# EAGLE design firefly-light (EAGLE 9.5.2)
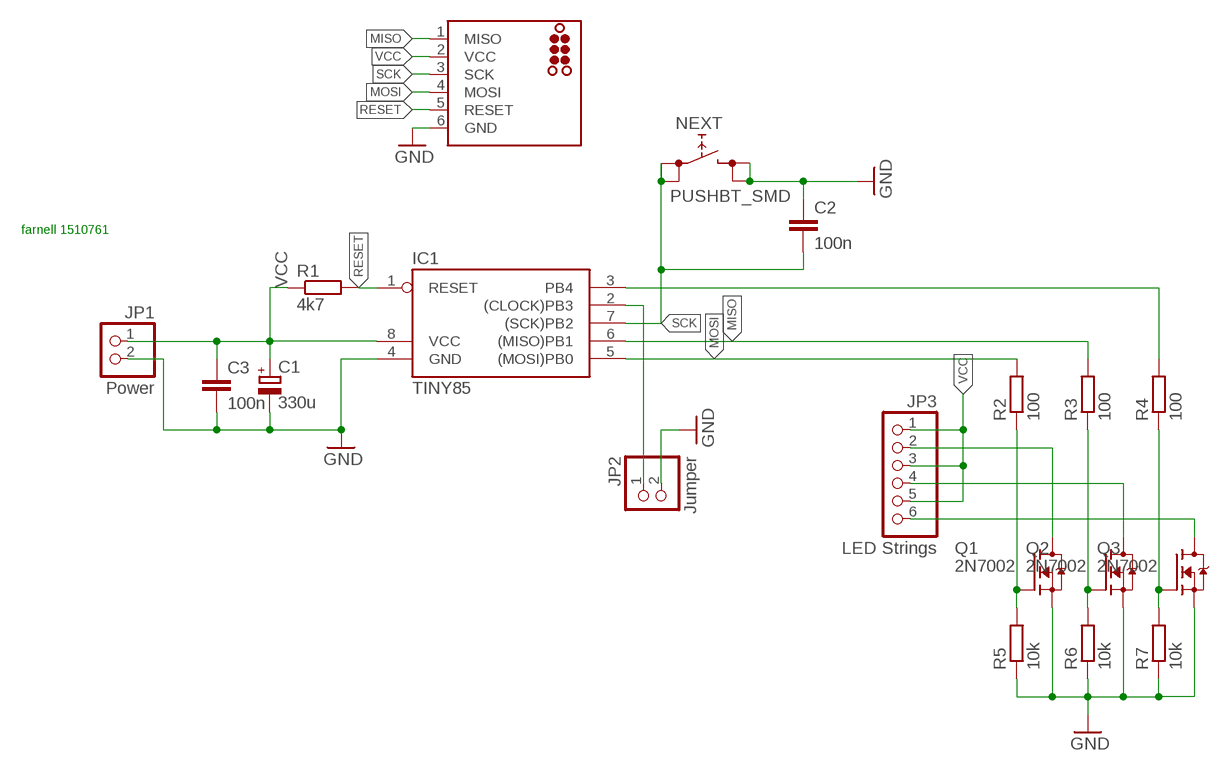
[diagram p0: schematic, sheet 1]

## Parts
C1  330u  CPOL-EUE3.5-8  [E3,5-8]
C2  100n  C-EUC0805  [C0805]
C3  100n  C-EUC0805  [C0805]
IC1  TINY85  TINY22S  [SOIC8]
ISP  TC2030-MCP-NL  [TC2030-MCP-NL]
JP1  Power  PINHD-1X2  [1X02]
JP2  Jumper  PINHD-1X2  [1X02]
JP3  LED Strings  PINHD-1X6  [1X06]
NEXT  PUSHBT_SMD  [PUSHBUTTON]
Q1  2N7002  [SOT-23]
Q2  2N7002  [SOT-23]
Q3  2N7002  [SOT-23]
R1  4k7  R-EU_R0805  [R0805]
R2  100  R-EU_R0805  [R0805]
R3  100  R-EU_R0805  [R0805]
R4  100  R-EU_R0805  [R0805]
R5  10k  R-EU_R0805  [R0805]
R6  10k  R-EU_R0805  [R0805]
R7  10k  R-EU_R0805  [R0805]

## Nets
GND: C1.- C2.1 C3.2 IC1.4(GND) ISP.6(GND) JP1.2 JP2.2 NEXT.B1 NEXT.B2 Q1.2(S) Q2.2(S) Q3.2(S) R5.1 R6.1 R7.1
MISO: IC1.6((MISO)PB1) ISP.1(MISO) R3.2
MOSI: IC1.5((MOSI)PB0) ISP.4(MOSI) R2.2
N$1: Q1.1(G) R2.1 R5.2
N$2: Q2.1(G) R3.1 R6.2
N$3: Q3.1(G) R4.1 R7.2
N$5: JP3.2 Q1.3(D)
N$6: JP3.4 Q2.3(D)
N$7: JP3.6 Q3.3(D)
N$12: IC1.3(PB4) R4.2
N$18: IC1.2((CLOCK)PB3) JP2.1
RESET: IC1.1(RESET) ISP.5(RESET) R1.2
SCK: C2.2 IC1.7((SCK)PB2) ISP.3(SCK) NEXT.A1 NEXT.A2
VCC: C1.+ C3.1 IC1.8(VCC) ISP.2(VCC) JP1.1 JP3.1 JP3.3 JP3.5 R1.1

## Notes on the sheet
- farnell 1510761

## Library data of the parts
C1 = rcl:CPOL-EU: POLARIZED CAPACITOR, European symbol; SPICEPREFIX: C
C2 C3 = rcl:C-EU: CAPACITOR, European symbol; SPICEPREFIX: C
IC1 = atmel:TINY22: MICROCONTROLLER 1K ROM 128 bytes RAM 128 bytes EEPROM; OC_FARNELL: unknown; OC_NEWARK: unknown
ISP = Meine:TC2030: TAG-CONNECT ISP Connector Manufacturer: Tag-Connect <www.tag-connect.com> Cable for easy In-Circuit PCB Programming. Designed for Microchip ICD2, suitable for many others. Two variants - one "with legs" (for hads-free fit on PCB) and another "without legs" for quick programming. PAD Description 1 MCLR/Vpp 2 Vdd 3 GND 4 PGD (ISPDAT) 5 PGC (ISPCLK) 6 nc (used for LVP) ©2009 ROFA.cz
JP1 JP2 = pinhead:PINHD-1X2: PIN HEADER
JP3 = pinhead:PINHD-1X6: PIN HEADER
NEXT = shyd:PUSHBT
Q1-Q3 = Meine:2N7002
R1-R7 = rcl:R-EU_: RESISTOR, European symbol; SPICEPREFIX: R

## Board
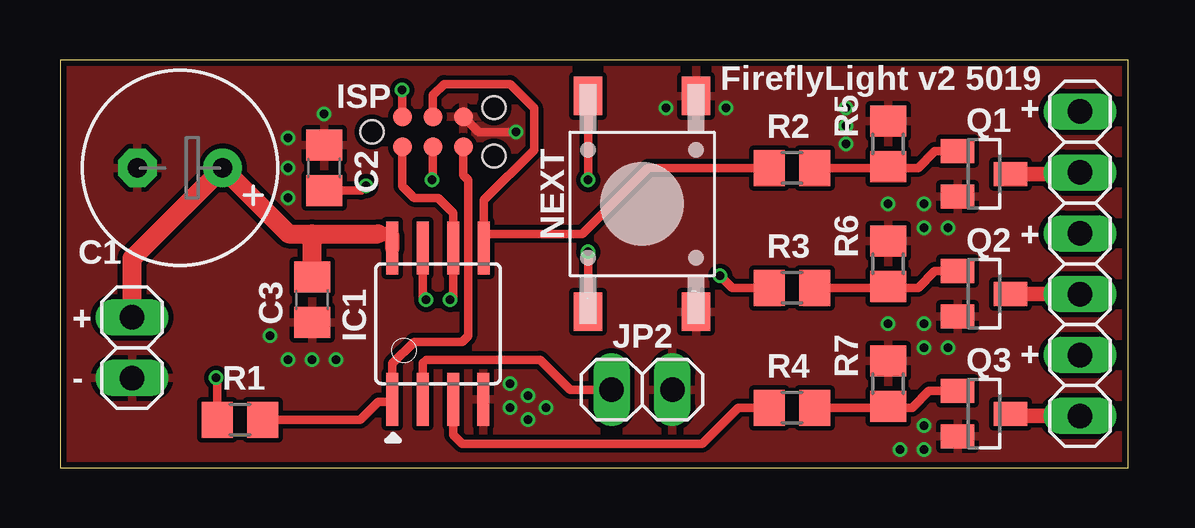
[diagram p1: board, top side]
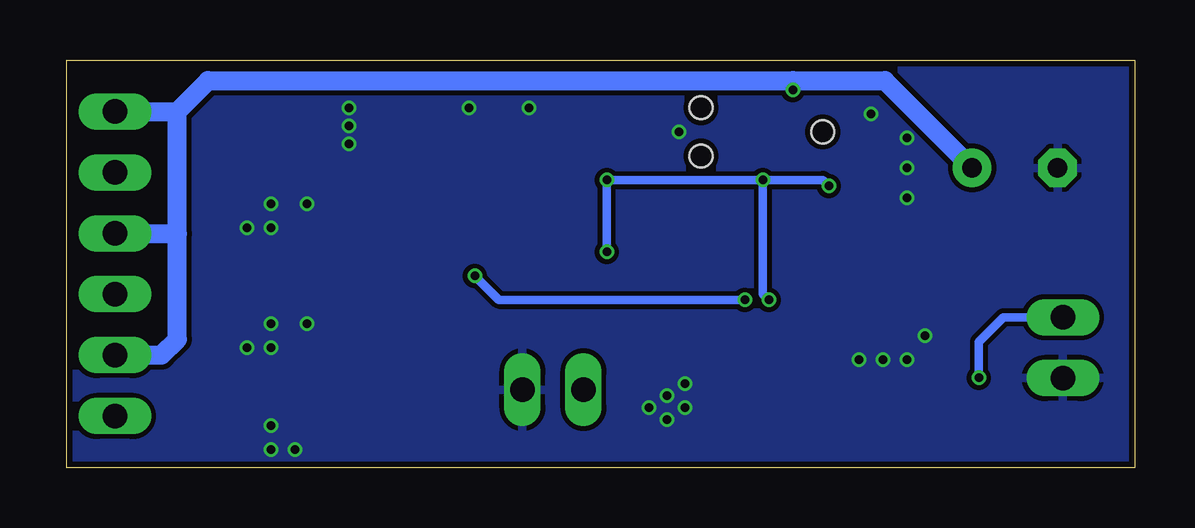
[diagram p2: board, bottom side, seen from below]

Size 44.5 x 17 mm. Coordinates in mm from the lower left corner, seen from the top.
Outline: 0,0 44.5,0 44.5,17 0,17 0,0
Copper layers (1*16): Top 0.018mm / dielectric 1.55mm / Bottom 0.018mm
Design rules "eC_2Layer_PClass6_BaseCopperO18_eCDefault *": minimum track width 0.15mm, minimum drill 0.35mm, track to track 0.15mm, track to pad 0.15mm, pad to pad 0.15mm, via to via 0.15mm, smd to smd 0mil, copper to edge 0.25mm, drill to drill 0.35mm, minimum pad ring 0.175mm, minimum via ring 0.125mm, stop-mask expansion 0mil, vias tented up to drill 0.45mm, thermal gap 0.2mm

### Footprints (pad centres in the part's own frame; a part is rotated, then mirrored left to right if it is on the bottom)
E3,5-8 = drill 0.813 pad 1.6: + -1.778,0 | drill 0.813 pad 1.6 octagon: - 1.778,0
C0805 = smd 1.3 x 1.5: 1 -0.95,0; 2 0.95,0
SOIC8 = smd 0.5 x 2.2: 1 -1.905,-3.154; 2 -0.645,-3.154; 3 0.625,-3.154; 4 1.895,-3.154; 5 1.905,3.154; 6 0.635,3.154; 7 -0.635,3.154; 8 -1.905,3.154
TC2030-MCP-NL = smd 0.787 x 0.787: 1 1.27,-0.635; 2 1.27,0.635; 3 2.54,-0.635; 4 2.54,0.635; 5 3.81,-0.635; 6 3.81,0.635 | hole 0.95: 0,0; 5.08,-1.016; 5.08,1.016
1X02 = drill 1.016 long: 1 -1.27,0; 2 1.27,0
1X06 = drill 1.016 long: 1 -6.35,0; 2 -3.81,0; 3 -1.27,0; 4 1.27,0; 5 3.81,0; 6 6.35,0
PUSHBUTTON = smd 1.6 x 1.2: A1 0,4.5; A2 9,4.5; B1 0,0; B2 9,0
SOT-23 = smd 1 x 1.4: 1 -0.95,-1.1; 2 0.95,-1.1; 3 0,1.1
R0805 = smd 1.3 x 1.5: 1 -0.95,0; 2 0.95,0

### Placement (x,y rotation side)
C1  5,12.5 180 top
C2  11,12.5 270 top
C3  10.5,7 270 top
IC1  15.75,6 0 top
ISP  13,14 0 top
JP1  3,5 270 top
JP2  24.25,3.25 0 top
JP3  42.5,8.5 270 top
NEXT  26.5,6.5 90 top
Q1  38.5,12.25 270 top
Q2  38.5,7.25 270 top
Q3  38.5,2.25 270 top
R1  7.5,2 0 top
R2  30.5,12.5 180 top
R3  30.5,7.5 180 top
R4  30.5,2.5 180 top
R5  34.5,13.5 270 top
R6  34.5,8.5 270 top
R7  34.5,3.5 270 top

### Tracks (layer width: path | path; a pad name or v marks a point on that pad's centre or on a via)
GND  (via drill 0.35)
  Top 0.35: ISP.6 17.45,14 v19,14
  other vias: 36,11 36,10 37,10 34.5,11 34.5,6 36,6 36,5 37,5 36,0.75 35,0.75 36,1.75 32.75,14.25 32.75,15 32.75,13.5 25.25,15 27.75,15 9.5,13.75 9.5,11.25 9.5,12.5 11,14.75 8.75,5.5 11.5,4.5 9.5,4.5 10.5,4.5 18.75,3.5 18.75,2.5 20.25,2.5 19.5,3 19.5,2
  pour Top (isolate 0.2): 0,0 0,17 44.5,17 44.5,0
  pour Bottom (isolate 0.2): 0,17 0,0 44.5,0 44.5,17
MISO  (via drill 0.35)
  Top 0.35: v27.5,8 28,7.5 R3.2 | v16.25,7 16.39,7.13 IC1.6 16.39,10.62 15.75,11.25 14.75,11.25 14.27,11.73 ISP.1
  Bottom 0.35: v27.5,8 26.5,7 v16.25,7
MOSI
  Top 0.35: ISP.4 15.54,15.54 16,16 18.75,16 19.75,15 19.75,13.25 17.66,11.15 17.66,9.75 | R2.2 24.5,12.5 21.75,9.75 17.66,9.75 | 17.66,9.75 IC1.5
N$1
  Top 0.35: Q1.1 36.45,13.2 35.75,12.5 34.55,12.5 R5.2 34.45,12.5 R2.1
N$2
  Top 0.35: Q2.1 36.45,8.2 35.75,7.5 34.55,7.5 R6.2 34.45,7.5 R3.1
N$3
  Top 0.35: Q3.1 36.2,3.2 35.5,2.5 34.55,2.5 R7.2 34.45,2.5 R4.1
N$5
  Top 0.6: JP3.2 42.44,12.25 Q1.3
N$6
  Top 0.6: JP3.4 39.62,7.23 Q2.3
N$7
  Top 0.6: JP3.6 39.7,2.15 Q3.3
N$12
  Top 0.35: R4.2 28.25,2.5 26.75,1 16.75,1 16.38,1.38 IC1.3
N$18
  Top 0.35: JP2.1 21.25,3.25 20,4.5 15.25,4.5 15.11,4.36 IC1.2
RESET
  Top 0.35: R1.2 12.5,2 13.25,2.75 13.75,2.75 IC1.1 13.85,4.34 14.75,5.25 16.75,5.25 17,5.5 17,12 16.81,12.19 ISP.5
SCK  (via drill 0.35)
  Top 0.35: ISP.3 15.54,12.04 v15.5,12 | NEXT.A2 v22,12 | NEXT.A1 v22,9 | v12.75,11.75 12.55,11.55 C2.2 | v15.25,7 15.12,7.13 IC1.7
  Bottom 0.35: v15.5,12 v22,12 v22,9 | v15.5,12 13,12 v12.75,11.75 | v15.5,12 15.5,7.25 v15.25,7
VCC  (via drill 0.35)
  Top 0.35: ISP.2 14.27,15.73 v14.25,15.75 | v6.5,3.75 6.55,3.7 R1.1
  Top 0.6: 13.25,9.75 13.75,9.75 13.85,9.65 IC1.8
  Top 0.8: JP1.1 3,8.72 C1.+ 9.53,9.75 10.5,9.75 | 10.5,9.75 13.25,9.75 | C3.1 10.5,9.75
  Bottom 0.35: v14.25,15.75 14.25,16.14 | JP1.1 5.48,6.27 6.5,5.25 v6.5,3.75
  Bottom 0.8: JP3.1 39.9,14.85 | C1.+ 10.42,16.14 14.25,16.14 38.61,16.14 39.9,14.85 | JP3.5 40.56,4.69 39.9,5.35 39.9,9.75 | 39.9,9.75 39.9,14.85 | JP3.3 39.92,9.77 39.9,9.75

### Text on the board
tNames: FireflyLight v2 5019 | + | + | + | + | -